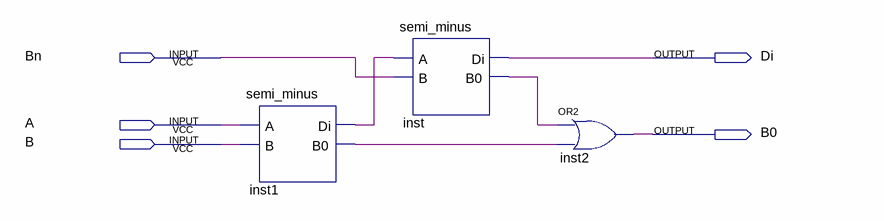
[diagram p0: schematic sheet]
// Quartus schematic minus.bdf as structural Verilog: 3 symbols, 5 pins
module minus (
  input  Bn,
  input  A,
  input  B,
  output Di,
  output B0
);

  wire inst1_b0, inst1_di, inst_b0;

  semi_minus inst1 (.A(A), .B(B), .Di(inst1_di), .B0(inst1_b0));
  semi_minus inst (.A(inst1_di), .B(Bn), .Di(Di), .B0(inst_b0));
  or inst2 (B0, inst_b0, inst1_b0);
endmodule
